# EAGLE board BRD1001-X00-002 - Switching Register (EAGLE 9.4.2), part 1 of 2
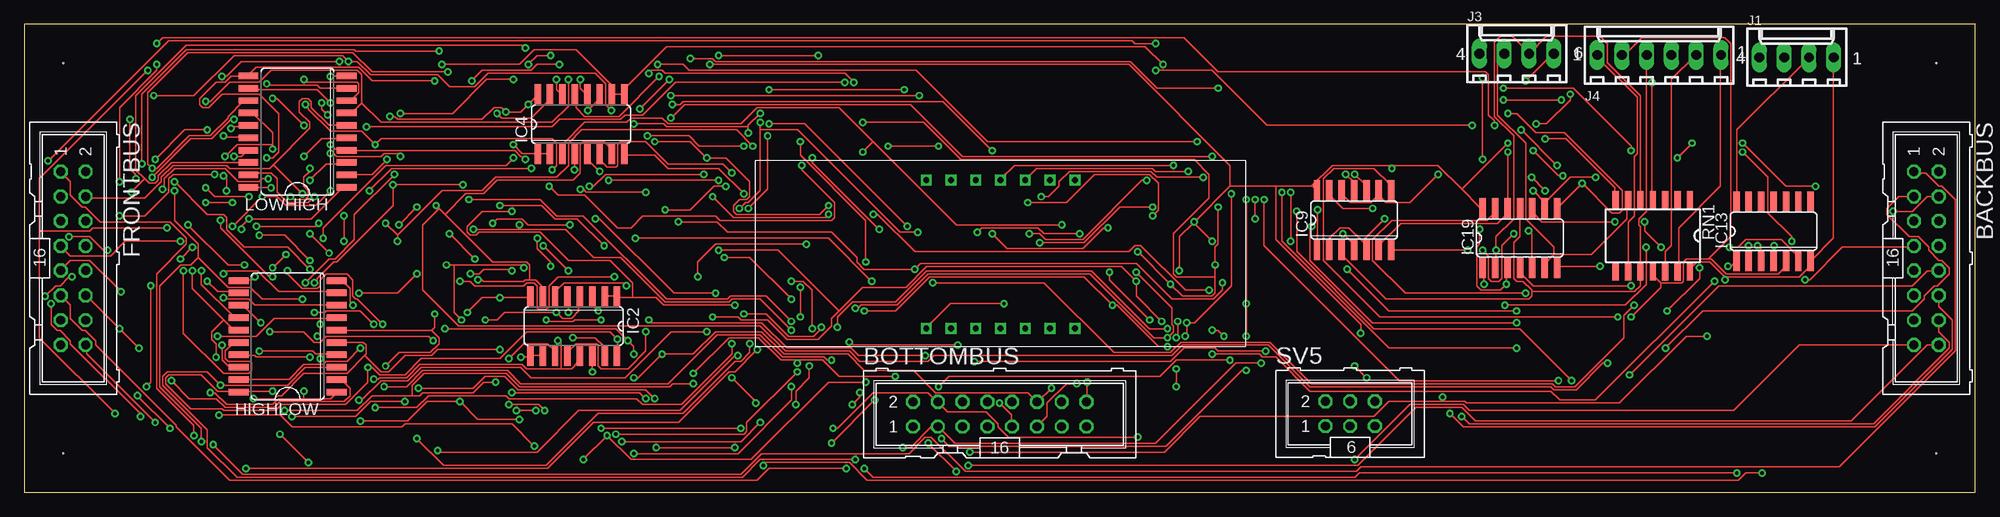
[diagram p1: board, top side]
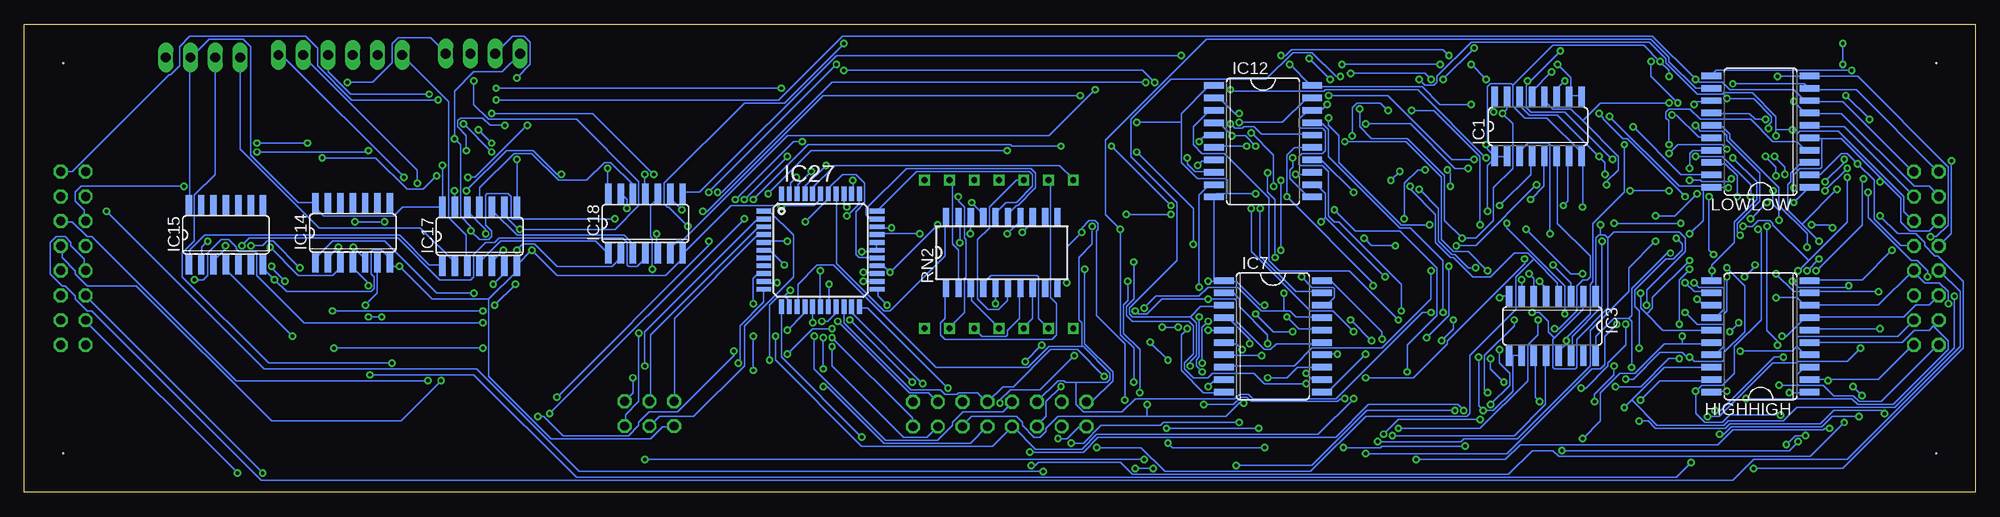
[diagram p2: board, bottom side, seen from below]

Size 200 x 48 mm. Coordinates in mm from the lower left corner, seen from the top.
Outline: 0,0 200,0 200,48 0,48 0,0
Copper layers (1*16): Top 0.035mm / dielectric 1.5mm / Bottom 0.035mm
Design rules "default": minimum track width 6mil, minimum drill 0.35mm, track to track 6mil, track to pad 6mil, pad to pad 6mil, via to via 6mil, smd to smd 6mil, copper to edge 40mil, drill to drill 6mil, minimum pad ring 10mil, minimum via ring 8mil, stop-mask expansion 4mil, vias tented up to drill 0mil, thermal gap 10mil
Holes 0.12 mm at 4,4 196,44 4,44 196,4

## Footprints (pad centres in the part's own frame; a part is rotated, then mirrored left to right if it is on the bottom)
ML16 = drill 0.914 octagon: 1 -8.89,-1.27; 2 -8.89,1.27; 3 -6.35,-1.27; 4 -6.35,1.27; 5 -3.81,-1.27; 6 -3.81,1.27; 7 -1.27,-1.27; 8 -1.27,1.27; 9 1.27,-1.27; 10 1.27,1.27; 11 3.81,-1.27; 12 3.81,1.27; 13 6.35,-1.27; 14 6.35,1.27; 15 8.89,-1.27; 16 8.89,1.27
SO20W = smd 0.66 x 2.032: 1 -5.715,-5.029; 2 -4.445,-5.029; 3 -3.175,-5.029; 4 -1.905,-5.029; 5 -0.635,-5.029; 6 0.635,-5.029; 7 1.905,-5.029; 8 3.175,-5.029; 9 4.445,-5.029; 10 5.715,-5.029; 11 5.715,5.029; 12 4.445,5.029; 13 3.175,5.029; 14 1.905,5.029; 15 0.635,5.029; 16 -0.635,5.029; 17 -1.905,5.029; 18 -3.175,5.029; 19 -4.445,5.029; 20 -5.715,5.029
SO16 = smd 0.66 x 2.032: 1 -4.445,-3.073; 2 -3.175,-3.073; 3 -1.905,-3.073; 4 -0.635,-3.073; 5 0.635,-3.073; 6 1.905,-3.073; 7 3.175,-3.073; 8 4.445,-3.073; 9 4.445,3.073; 10 3.175,3.073; 11 1.905,3.073; 12 0.635,3.073; 13 -0.635,3.073; 14 -1.905,3.073; 15 -3.175,3.073; 16 -4.445,3.073
SO14 = smd 0.66 x 2.032: 1 -3.81,-3.073; 2 -2.54,-3.073; 3 -1.27,-3.073; 4 0,-3.073; 5 1.27,-3.073; 6 2.54,-3.073; 7 3.81,-3.073; 8 3.81,3.073; 9 2.54,3.073; 10 1.27,3.073; 11 0,3.073; 12 -1.27,3.073; 13 -2.54,3.073; 14 -3.81,3.073
TQFP44 = smd 1.5 x 0.5: 1 -5.8,4; 2 -5.8,3.2; 3 -5.8,2.4; 4 -5.8,1.6; 5 -5.8,0.8; 6 -5.8,0; 7 -5.8,-0.8; 8 -5.8,-1.6; 9 -5.8,-2.4; 10 -5.8,-3.2; 11 -5.8,-4; 23 5.8,-4; 24 5.8,-3.2; 25 5.8,-2.4; 26 5.8,-1.6; 27 5.8,-0.8; 28 5.8,0; 29 5.8,0.8; 30 5.8,1.6; 31 5.8,2.4; 32 5.8,3.2; 33 5.8,4 | smd 0.5 x 1.5: 12 -4,-5.8; 13 -3.2,-5.8; 14 -2.4,-5.8; 15 -1.6,-5.8; 16 -0.8,-5.8; 17 0,-5.8; 18 0.8,-5.8; 19 1.6,-5.8; 20 2.4,-5.8; 21 3.2,-5.8; 22 4,-5.8; 34 4,5.8; 35 3.2,5.8; 36 2.4,5.8; 37 1.6,5.8; 38 0.8,5.8; 39 0,5.8; 40 -0.8,5.8; 41 -1.6,5.8; 42 -2.4,5.8; 43 -3.2,5.8; 44 -4,5.8
6410-04 = drill 1.016 long: 1 3.81,0; 2 1.27,0; 3 -1.27,0; 4 -3.81,0
6410-06 = drill 1.016 long: 1 6.35,0; 2 3.81,0; 3 1.27,0; 4 -1.27,0; 5 -3.81,0; 6 -6.35,0
SOMC14 = smd 1.91 x 0.64: 1 -3.62,3.81; 2 -3.62,2.54; 3 -3.62,1.27; 4 -3.62,0; 5 -3.62,-1.27; 6 -3.62,-2.54; 7 -3.62,-3.81; 8 3.62,-3.81; 9 3.62,-2.54; 10 3.62,-1.27; 11 3.62,0; 12 3.62,1.27; 13 3.62,2.54; 14 3.62,3.81
SOMC20 = smd 1.91 x 0.64: 1 -3.62,5.715; 2 -3.62,4.445; 3 -3.62,3.175; 4 -3.62,1.905; 5 -3.62,0.635; 6 -3.62,-0.635; 7 -3.62,-1.905; 8 -3.62,-3.175; 9 -3.62,-4.445; 10 -3.62,-5.715; 11 3.62,-5.715; 12 3.62,-4.445; 13 3.62,-3.175; 14 3.62,-1.905; 15 3.62,-0.635; 16 3.62,0.635; 17 3.62,1.905; 18 3.62,3.175; 19 3.62,4.445; 20 3.62,5.715
ML6 = drill 0.914 octagon: 1 -2.54,-1.27; 2 -2.54,1.27; 3 0,-1.27; 4 0,1.27; 5 2.54,-1.27; 6 2.54,1.27
4-DIGIT-7-SEGMENT = drill 0.6 square: PIN1 17.48,1.88; PIN2 20.02,1.88; PIN3 22.56,1.88; PIN4 25.1,1.88; PIN5 27.64,1.88; PIN6 30.18,1.88; PIN7 32.72,1.88; PIN8 32.72,17.12; PIN9 30.18,17.12; PIN10 27.64,17.12; PIN11 25.1,17.12; PIN12 22.56,17.12; PIN13 20.02,17.12; PIN14 17.48,17.12

## Placement (x,y rotation side)
BACKBUS  [ML16]  195,24 270 top
BOTTOMBUS  [ML16]  100,8 0 top
FRONTBUS  [ML16]  5,24 270 top
HIGHHIGH  74AC245DW  [SO20W]  22,16 90 bottom
HIGHLOW  74AC245DW  [SO20W]  27,16 90 top
IC1  74HC173D  [SO16]  44.8,37.53 0 bottom
IC2  74HC173D  [SO16]  56.32,17.04 180 top
IC3  74HC173D  [SO16]  43.34,17.05 180 bottom
IC4  74HC173D  [SO16]  57.07,37.75 0 top
IC7  74AC245DW  [SO20W]  72,16 270 bottom
IC9  74ALS02D  [SO14]  136.33,27.93 0 top
IC12  74AC245DW  [SO20W]  73,36 270 bottom
IC13  74ALS02D  [SO14]  179.33,26.77 0 top
IC14  74ALS00D  [SO14]  166.33,26.61 0 bottom
IC15  74ALS04D  [SO14]  179.33,26.41 0 bottom
IC17  74ALS02D  [SO14]  153.33,26.25 0 bottom
IC18  74ALS04D  [SO14]  136.33,27.57 0 bottom
IC19  74ALS02D  [SO14]  153.33,26.09 0 top
IC27  MEGA8535-A  [TQFP44]  118.38,24.83 0 bottom
J1  22-27-2041-04  [6410-04]  181.7,44.61 0 top
J3  22-27-2041-04  [6410-04]  153,45 0 top
J4  22-27-2061-06  [6410-06]  167.6,44.86 0 top
LOWHIGH  74AC245DW  [SO20W]  28,37 90 top
LOWLOW  74AC245DW  [SO20W]  22,37 90 bottom
RN1  [SOMC14]  166.95,26.32 270 top
RN2  [SOMC20]  99.79,24.59 90 bottom
SV5  [ML6]  135.92,8.05 0 top
U$1  4-DIGIT-7-SEGMENT  [4-DIGIT-7-SEGMENT]  74.98,14.92 0 top

## Tracks (layer width: path | path; a pad name or v marks a point on that pad's centre or on a via)
!HIGH_HIGH  (via drill 0.35)
  Top 0.152: v34.29,9.45 34.59,9.45 36.58,11.43 39.32,11.43 40.69,12.8 50.9,12.8 51.97,11.73 61.57,11.73 66.29,16.46 v69.95,16.46 | v73.76,18.29 76.05,18.29 78.33,16 80.92,16 81.69,16.76 v81.69,16.92 | v83.36,16.92 83.36,17.98 84.89,19.51 89.31,19.51 92.51,22.71 109.42,22.71 115.37,16.76 v117.2,16.76 | v121.77,14.17 126.64,14.17 126.95,13.87 128.32,13.87 131.83,10.36 156.51,10.36 157.43,9.45 161.09,9.45 v173.28,21.64 | v174.65,23.16 174.96,23.16 175.41,23.62 IC13.1
  Bottom 0.152: v34.29,9.45 32.31,11.43 27.13,11.43 HIGHHIGH.19 | v69.95,16.46 71.93,16.46 v73.76,18.29 | v83.36,16.92 v81.69,16.92 | v117.2,16.76 119.18,16.76 v121.77,14.17 | v173.28,21.64 174.65,23.01 v174.65,23.16
!HIGH_LOW  (via drill 0.35)
  Top 0.152: v34.44,14.78 33.07,13.41 30.94,13.41 30.63,13.11 28.65,13.11 27.13,11.58 22.1,11.58 HIGHLOW.19 | v30.63,26.06 30.63,27.13 37.03,33.53 49.38,33.53 v50.14,34.29 | v90.22,41.3 v76.35,41.3
  Bottom 0.152: v34.44,14.78 34.44,18.59 34.9,19.05 34.9,20.73 31.7,23.93 30.94,23.93 30.02,24.84 30.02,25.45 v30.63,26.06 | v50.14,34.29 57.15,41.3 66.6,41.3 66.75,41.15 76.2,41.15 v76.35,41.3 | v90.22,41.3 94.94,36.58 121.77,36.58 132.59,25.76 133.04,25.76 133.66,25.15 133.66,24.54 IC18.6
!LOW_HIGH  (via drill 0.35)
  Top 0.152: v71.17,44.81 v81.38,44.81 | v53.95,44.81 52.58,44.81 v51.66,43.89 | v50.14,42.37 47.4,42.37 43.89,38.86 v38.56,38.86 | v29.72,30.33 29.11,29.72 26.98,29.72 25.91,30.79 25.91,32.16 25.3,32.77 23.16,32.77 23.01,32.61 LOWHIGH.19
  Bottom 0.152: v81.38,44.81 116.74,44.81 130.76,30.79 132.44,30.79 IC18.8 | v71.17,44.81 70.71,44.81 70.1,45.41 54.56,45.41 v53.95,44.81 | v50.14,42.37 v51.66,43.89 | v38.56,38.86 38.1,38.41 38.1,38.25 36.12,36.27 35.66,36.27 v29.72,30.33
!LOW_LOW  (via drill 0.35)
  Top 0.152: v154.53,32.31 v155.91,30.94 | v148.44,37.64 127.41,37.64 121.77,43.28 v115.98,43.28 | v84.12,42.06 66.75,42.06 63.4,38.71 61.57,38.71 61.11,38.25 54.86,38.25 54.1,37.49 v35.05,37.49
  Bottom 0.152: v155.91,30.94 155.91,29.41 IC17.13 | v154.53,32.31 153.77,32.31 v148.44,37.64 | v115.98,43.28 85.34,43.28 v84.12,42.06 | v35.05,37.49 30.18,32.61 27.13,32.61 LOWLOW.19
!REG_IN  (via drill 0.35)
  Top 0.152: v42.82,43.89 50.75,43.89 52.27,45.41 56.54,45.41 60.2,41.76 60.2,40.84 IC4.10 60.35,40.84 61.42,40.84 IC4.9 61.57,40.84 61.57,41.45 65.84,45.72 114.91,45.72 v116.74,43.89 | IC2.10 53.03,14.02 51.97,14.02 IC2.9 51.82,13.87 v50.9,13.87 | v172.52,16 170.38,16 163.53,9.14 147.83,9.14 147.68,9.3 145.39,9.3 | 145.39,9.3 139.9,9.3 138.38,7.77 120.55,7.77 116.89,4.12 v96.93,4.12 | v50.44,8.38 v52.43,8.38 | v129.84,25.76 v129.84,30.79 | 145.39,9.3 v145.39,9.75
  Bottom 0.152: 41.45,40.69 41.6,40.69 IC1.10 41.45,40.69 | 41.45,40.69 40.39,40.69 IC1.9 | 41.45,40.69 41.45,42.52 v42.82,43.89 | 47.4,14.02 47.7,14.02 IC3.9 | 47.4,14.02 46.63,14.02 IC3.10 | v172.52,16 179.22,22.71 179.22,23.32 IC15.4 | v96.93,4.12 91.44,4.12 89.92,5.64 65.53,5.64 62.18,8.99 53.03,8.99 v52.43,8.38 | 47.4,14.02 47.4,10.36 49.38,8.38 v50.44,8.38 50.9,8.84 v50.9,13.87 | v129.84,30.79 v116.74,43.89 | v129.84,25.76 129.84,25.3 v145.39,9.75
!REG_OUT  (via drill 0.35)
  Top 0.152: v19.05,10.21 19.51,10.21 20.73,8.99 25.45,8.99 26.06,9.6 28.65,9.6 | 28.65,9.6 31.39,9.6 32,10.21 HIGHLOW.1 | v21.34,29.72 v18.59,29.72 | LOWHIGH.1 32.92,31.24 32.61,31.24 29.41,28.04 v23.01,28.04 22.25,27.28 v22.25,26.98 | v28.65,10.36 28.65,9.6 | v73.3,29.11 73.91,29.72 74.22,29.72 75.44,30.94 75.44,37.19 | v75.44,37.95 75.44,37.19 | v165.05,19.2 163.98,18.14 163.98,15.85 158.95,10.82 156.97,10.82 156.67,11.12 131.98,11.12 127.71,15.39 118.57,15.39 117.5,14.33 111.71,14.33 104.55,21.49 v93.12,21.49 | v91.59,26.67 89.76,26.67 79.25,37.19 75.44,37.19 | v19.96,7.92 26.21,7.92 27.43,6.71 38.71,6.71 39.01,7.01 49.99,7.01 v52.27,4.72 | v72.85,4.57 v64.77,4.57 | v87.17,9.45 v82.75,5.03
  Bottom 0.152: v19.05,10.21 17.07,10.21 HIGHHIGH.1 | v18.59,29.72 17.07,31.24 LOWLOW.1 | v23.01,28.04 v21.34,29.72 | v22.25,26.98 21.95,26.67 21.95,17.68 24.69,14.94 24.69,12.19 25.91,10.97 28.04,10.97 v28.65,10.36 28.65,8.08 27.74,7.16 25.91,7.16 25.15,7.92 v19.96,7.92 | v73.3,29.11 73.3,24.23 69.65,20.57 67.06,20.57 IC7.19 | v75.44,37.95 71.02,37.95 68.58,40.39 68.12,40.39 IC12.19 | v165.05,19.2 163.83,20.42 163.83,23.47 IC14.6 | v93.12,21.49 93.12,25.15 v91.59,26.67 91.59,27.13 90.83,27.89 90.22,27.89 89.92,27.58 89.92,26.98 90.07,26.82 90.07,18.14 87.17,15.24 v87.17,9.45 | v52.27,4.72 60.81,4.72 60.96,4.57 v64.77,4.57 | v72.85,4.57 82.3,4.57 v82.75,5.03
A
  Bottom 0.152: IC27.37 116.74,30.48 116.74,23.47 111.86,18.59 111.25,18.59 105.61,24.23 105.61,28.19 RN2.20
B  (via drill 0.35)
  Top 0.152: v115.67,29.26 112.32,29.26 108.66,25.6 v104.09,25.6
  Bottom 0.152: v115.67,29.26 115.98,29.57 115.98,30.48 IC27.36 | v104.09,25.6 104.09,28.19 RN2.19
BUS0  (via drill 0.35)
  Top 0.152: v34.44,7.32 39.32,7.32 41.3,9.3 v44.65,9.3 46.48,7.47 v50.75,7.47 | v9.3,8.08 1.52,15.85 1.52,26.82 | 1.52,26.82 1.52,32.16 v12.65,43.28 | v23.62,22.1 23.32,21.79 22.1,21.79 HIGHLOW.11 | v22.55,23.32 20.88,23.32 v16.76,27.43 | v14.63,27.13 7.01,27.13 6.71,26.82 1.52,26.82 | v79.55,17.98 v79.55,21.03 | v79.25,12.34 74.07,7.16 74.07,6.25 73.76,5.94 v60.66,5.94
  Bottom 0.152: v44.65,9.3 45.11,9.75 45.11,13.87 IC3.11 | v34.44,7.32 33.53,7.32 32.77,6.55 25.6,6.55 25.15,7.01 15.85,7.01 14.48,8.38 9.6,8.38 v9.3,8.08 | v12.65,43.28 26.52,43.28 26.98,42.82 LOWLOW.11 | v23.62,22.1 22.55,23.16 v22.55,23.32 | v16.76,27.43 14.94,27.43 v14.63,27.13 | v79.55,21.03 79.55,30.48 78.49,31.55 78.18,31.55 IC12.9 | v79.55,17.98 79.55,13.87 79.86,13.56 79.86,12.95 v79.25,12.34 | v60.66,5.94 59.13,7.47 v50.75,7.47
BUS1  (via drill 0.35)
  Top 0.152: v86.26,11.28 82.45,11.28 74.52,3.35 62.18,3.35 v59.74,5.79 v57.3,3.35 | v87.63,26.98 80.77,33.83 v80.77,34.29 | v18.75,21.64 19.81,20.57 21.95,20.57 HIGHLOW.12 | v12.95,21.18 12.95,11.28 v12.5,10.82 | v14.94,6.55 v11.58,9.91
  Bottom 0.152: v59.74,5.79 47.24,5.79 44.04,8.99 44.04,13.87 IC3.12 | v86.26,11.28 86.26,14.78 87.63,16.15 v87.63,26.98 89.15,28.5 89.15,36.12 78.79,46.48 33.22,46.48 31.39,44.65 31.39,44.2 28.65,41.45 27.13,41.45 LOWLOW.12 | v80.77,34.29 80.77,33.68 80.01,32.92 78.18,32.92 IC12.8 | v18.75,21.64 18.14,21.03 13.11,21.03 v12.95,21.18 | v11.58,9.91 v12.5,10.82 | v14.94,6.55 15.39,6.55 15.54,6.4 24.84,6.4 26.36,4.88 46.63,4.88 48.16,3.35 v57.3,3.35
BUS2  (via drill 0.35)
  Top 0.152: v24.23,17.37 22.55,19.05 22.1,19.05 HIGHLOW.13 | v25.15,16.46 28.65,16.46 29.72,15.39 30.33,15.39 30.94,16 41.45,16 v41.91,15.54 | v28.8,39.78 29.11,39.47 29.11,39.32 31.39,37.03 34.59,37.03 v35.97,35.66 36.58,36.27 54.1,36.27 54.56,35.81 54.56,33.53 v54.1,33.07 | v79.7,33.53 79.7,33.07 83.06,29.72 83.06,28.19 82.75,27.89 71.32,27.89 70.87,28.35 63.4,28.35 62.18,27.13 60.81,27.13 57.45,30.48 54.71,30.48 v53.8,31.39
  Bottom 0.152: v25.15,16.46 v24.23,17.37 | IC3.13 42.67,14.02 42.67,14.48 41.91,15.24 v41.91,15.54 41.91,15.85 39.47,18.29 39.47,21.34 39.17,21.64 39.17,27.58 35.97,30.79 v35.97,35.66 | v28.8,39.78 28.5,40.08 27.13,40.08 LOWLOW.13 | v79.7,33.53 79.25,33.98 78.18,33.98 IC12.7 | v53.8,31.39 53.8,32.77 v54.1,33.07
BUS3  (via drill 0.35)
  Top 0.152: v18.14,22.71 18.14,21.34 21.49,17.98 21.95,17.98 HIGHLOW.14 | v13.11,32.31 17.07,36.27 19.2,36.27 21.18,38.25 v21.49,38.25 | 38.25,26.36 v38.25,25.76 | 38.25,26.36 42.82,30.94 46.94,30.94 48.31,32.31 54.56,32.31 55.78,33.53 55.78,35.81 57.15,37.19 73,37.19 v74.68,35.51 | v23.77,27.28 29.87,27.28 v30.18,27.58 | 38.25,26.36 v37.03,27.58
  Bottom 0.152: 17.07,23.77 13.11,27.74 v13.11,32.31 | 17.07,23.77 v18.14,22.71 | v21.49,38.25 22.55,38.25 23.16,38.86 26.98,38.86 LOWLOW.14 | v38.25,25.76 38.25,19.05 41.3,16 41.3,14.02 IC3.14 | v74.68,35.51 78.03,35.51 IC12.6 | 17.07,23.77 20.73,27.43 20.73,27.58 21.03,27.89 22.25,27.89 22.86,27.28 v23.77,27.28 | v37.03,27.58 v30.18,27.58
BUS4  (via drill 0.35)
  Top 0.152: 20.42,17.68 17.22,20.88 v17.22,22.71 | 20.42,17.68 21.34,16.76 21.95,16.76 HIGHLOW.15 | v17.22,25.15 v16,23.93 | v49.68,13.72 51.21,15.24 53.65,15.24 54.41,14.48 54.41,14.02 IC2.11 | v48.31,11.28 47.09,11.28 46.02,10.21 40.84,10.21 40.54,9.91 39.78,9.91 | 39.78,9.91 35.66,9.91 34.14,8.38 v26.67,8.38 | v19.66,13.87 19.66,15.24 19.2,15.7 19.2,16.46 20.42,17.68 | v79.55,35.97 79.55,34.59 86.26,27.89 v86.26,23.62 | v68.58,11.12 66.45,11.12 66.14,10.82 50.75,10.82 49.38,12.19 41,12.19 39.78,10.97 39.78,9.91
  Bottom 0.152: v16,23.93 v17.22,22.71 | v17.22,25.15 17.22,26.52 20.12,29.41 20.12,31.24 25.15,36.27 25.15,36.73 25.91,37.49 26.98,37.49 LOWLOW.15 | v49.68,13.72 49.68,12.65 v48.31,11.28 | v26.67,8.38 26.06,8.38 20.57,13.87 v19.66,13.87 | v79.55,35.97 78.94,36.58 78.18,36.58 IC12.5 | v86.26,23.62 86.26,19.81 87.02,19.05 87.02,18.14 86.41,17.53 80.62,17.53 80.16,17.07 80.16,14.17 81.08,13.26 81.08,12.65 80.16,11.73 78.64,11.73 78.18,12.19 73.91,12.19 72.85,11.12 v68.58,11.12
BUS5  (via drill 0.35)
  Top 0.152: v63.7,16.46 63.7,14.48 61.87,12.65 59.13,12.65 58.83,12.95 58.83,15.09 58.67,15.24 56.54,15.24 55.78,14.48 55.78,14.02 IC2.12 | v74.22,29.11 76.2,31.09 v76.2,36.58 | v16.31,22.71 16.31,16.31 20.42,12.19 23.01,12.19 23.32,12.5 23.32,13.26 23.16,13.41 20.88,13.41 20.57,13.72 20.57,14.48 21.34,15.24 21.95,15.24 HIGHLOW.16 | v11.43,32.16 11.43,32.61 10.82,33.22 v10.82,38.25 | v13.26,40.69 17.37,40.69 21.49,44.81 32.61,44.81 v33.22,44.2 34.14,44.2 35.51,42.82 42.37,42.82 43.59,41.6 46.18,41.6 47.55,42.98 58.52,42.98 59.59,41.91 59.59,39.78 v60.2,39.17 | v30.48,39.93 30.48,39.32 v31.09,38.71 | v73.76,35.51 69.19,35.51 68.12,36.58 v63.86,36.58
  Bottom 0.152: v63.7,16.46 65.84,18.59 68.12,18.59 74.22,24.69 v74.22,29.11 | IC12.4 78.03,37.8 77.42,37.8 v76.2,36.58 74.83,36.58 v73.76,35.51 | v16.31,22.71 11.58,27.43 11.58,32 v11.43,32.16 | v13.26,40.69 v10.82,38.25 | v33.22,44.2 33.22,42.67 v30.48,39.93 | v31.09,38.71 30.63,38.71 28.35,36.42 27.13,36.42 LOWLOW.16 | v63.86,36.58 63.86,39.47 63.4,39.93 60.96,39.93 v60.2,39.17
BUS6  (via drill 0.35)
  Top 0.152: v29.26,13.87 23.77,13.87 23.62,14.02 22.1,14.02 HIGHLOW.17 | v35.81,11.58 36.27,11.58 36.42,11.73 39.17,11.73 40.54,13.11 51.05,13.11 51.51,12.65 55.02,12.65 | 55.02,12.65 56.08,12.65 56.84,13.41 56.84,13.87 IC2.13 | v29.26,33.22 29.26,32.92 28.65,32.31 28.65,31.39 29.11,30.94 29.11,30.33 28.8,30.02 27.58,30.02 v27.28,30.33 | v25.45,23.01 v26.82,24.38 | v59.13,17.68 56.39,17.68 56.24,17.53 53.65,17.53 v53.49,17.68 | v54.71,15.54 55.02,15.24 55.02,12.65
  Bottom 0.152: v35.81,11.58 35.05,11.58 32.31,14.33 30.02,14.33 29.57,13.87 v29.26,13.87 28.8,13.41 25.91,13.41 25.76,13.56 25.76,14.33 23.62,16.46 23.62,21.18 v25.45,23.01 | v29.26,33.22 29.26,34.75 28.96,35.05 27.13,35.05 LOWLOW.17 | v27.28,30.33 27.28,24.84 v26.82,24.38 | v59.13,17.68 64.16,22.71 71.32,22.71 72.39,23.77 72.39,30.18 76.96,34.75 79.25,34.75 80.16,35.66 80.16,37.49 78.49,39.17 78.18,39.17 IC12.3 | v53.49,17.68 53.49,16.76 v54.71,15.54
BUS7  (via drill 0.35)
  Top 0.152: v20.27,15.09 20.27,13.56 20.88,12.95 21.95,12.95 HIGHLOW.18 | v21.34,27.28 v24.38,30.33 25.91,30.33 26.82,29.41 29.87,29.41 v31.39,30.94 | v58.22,12.34 58.22,13.87 IC2.14 | v65.68,28.96 68.28,28.96 70.71,31.39 v71.93,31.39 | 74.22,37.49 74.22,37.64 v75.44,38.86 | 74.22,37.49 v74.22,36.88 | v35.36,30.94 37.64,33.22 v51.97,33.22 | v62.48,37.8 65.53,37.8 65.84,37.49 74.22,37.49
  Bottom 0.152: v20.27,15.09 20.27,15.54 21.34,16.61 v21.34,27.28 | v24.38,30.33 24.38,32.46 25.6,33.68 26.98,33.68 LOWLOW.18 | v58.22,12.34 58.22,15.09 55.17,18.14 55.17,23.01 58.98,26.82 63.55,26.82 v65.68,28.96 | v71.93,31.39 71.93,34.59 v74.22,36.88 | v75.44,38.86 75.89,38.86 77.42,40.39 78.03,40.39 IC12.2 | v35.36,30.94 v31.39,30.94 | v51.97,33.22 53.34,33.22 57.91,37.8 v62.48,37.8
BUS8  (via drill 0.35)
  Top 0.152: v24.84,34.29 25.45,34.29 26.06,34.9 26.06,38.86 24.08,40.84 20.27,40.84 18.9,39.47 18.29,39.47 17.98,39.78 17.98,40.39 19.66,42.06 20.57,42.06 21.18,42.67 22.86,42.67 LOWHIGH.11 23.01,42.82 23.77,43.59 34.29,43.59 35.66,42.22 v42.06,42.22 | v78.64,10.82 78.64,9.45 73.15,3.96 v62.48,3.96 | v36.73,17.22 34.14,19.81 33.98,19.81 33.68,20.12 33.68,21.79 33.07,22.4 30.94,22.4 30.33,21.79 30.33,21.18 30.02,20.88 28.5,20.88 26.98,22.4 v26.98,22.71
  Bottom 0.152: v24.84,34.29 22.4,31.85 22.4,30.02 24.69,27.74 24.69,25.6 26.98,23.32 v26.98,22.71 26.98,21.79 HIGHHIGH.11 | v42.06,42.22 42.82,41.45 42.82,40.69 IC1.11 | v78.64,10.82 78.03,11.43 77.11,11.43 IC7.9 | v62.48,3.96 48.01,3.96 39.32,12.65 38.41,12.65 37.95,13.11 37.95,16 v36.73,17.22
BUS9  (via drill 0.35)
  Top 0.152: v29.72,21.49 30.02,21.79 30.02,21.95 31.7,23.62 32,23.62 37.8,29.41 v37.8,31.55 v44.96,31.55 | v53.19,25.3 v55.78,22.71 | v31.39,39.93 30.02,41.3 23.01,41.3 LOWHIGH.12
  Bottom 0.152: v29.72,21.49 28.8,20.57 27.13,20.57 HIGHHIGH.12 | v37.8,31.55 37.8,31.85 36.58,33.07 36.58,34.44 40.23,38.1 | 40.23,38.1 41.45,39.32 43.28,39.32 44.04,40.08 44.04,40.54 IC1.12 | v55.78,22.71 55.78,19.81 60.81,14.78 67.97,14.78 69.8,12.95 76.96,12.95 IC7.8 | v53.19,25.3 51.21,25.3 v44.96,31.55 | v31.39,39.93 38.41,39.93 40.23,38.1
BUS10  (via drill 0.35)
  Top 0.152: v28.5,19.81 24.38,19.81 23.16,21.03 20.88,21.03 17.83,24.08 | 17.83,24.08 17.83,25.45 15.39,27.89 v15.39,30.94 | LOWHIGH.13 22.86,40.08 22.4,40.08 20.88,38.56 20.88,38.41 19.05,36.58 16.92,36.58 13.56,33.22 v13.11,33.22 12.65,33.68 12.65,41 16.76,45.11 33.68,45.11 35.66,43.13 v43.43,43.13 | v73.15,14.02 72.85,14.02 67.21,8.38 56.84,8.38 52.58,4.12 42.52,4.12 v42.37,4.27 | v18.14,5.18 18.14,6.55 13.87,10.82 13.87,21.18 16,23.32 17.07,23.32 17.83,24.08
  Bottom 0.152: v28.5,19.81 27.89,19.2 27.13,19.2 HIGHHIGH.13 | v13.11,33.22 v15.39,30.94 | v73.15,14.02 76.96,14.02 IC7.7 | v42.37,4.27 19.05,4.27 v18.14,5.18 | v43.43,43.13 45.41,41.15 45.41,40.69 IC1.13
BUS11  (via drill 0.35)
  Top 0.152: v25.45,35.2 25.45,35.66 | 25.45,35.66 25.45,36.88 23.47,38.86 23.01,38.86 LOWHIGH.14 | v31.39,34.75 31.7,34.75 32,34.44 36.58,34.44 36.88,34.75 38.25,34.75 v38.56,34.44 | v28.8,21.49 31.24,23.93 31.85,23.93 33.83,25.91 33.83,28.5 v37.95,32.61 | v75.13,14.63 72.85,12.34 72.24,12.34 67.06,7.16 58.37,7.16 53.65,2.44 v22.71,2.44 | v9.75,28.35 12.34,28.35 14.78,30.79 14.78,32.16 15.24,32.61 v19.51,32.61 | v20.57,34.44 21.79,35.66 25.45,35.66
  Bottom 0.152: v25.45,35.2 25.91,35.66 30.48,35.66 v31.39,34.75 | IC1.14 46.63,40.54 46.63,39.62 45.72,38.71 42.82,38.71 v38.56,34.44 37.95,33.83 v37.95,32.61 | v28.8,21.49 28.35,21.03 25.91,21.03 25.76,20.88 25.76,18.75 26.52,17.98 26.98,17.98 HIGHHIGH.14 | v75.13,14.63 75.74,15.24 76.96,15.24 IC7.6 | v22.71,2.44 13.56,2.44 1.22,14.78 1.22,21.64 3.81,24.23 4.12,24.23 5.18,25.3 5.18,25.6 6.1,26.52 7.92,26.52 v9.75,28.35 | v19.51,32.61 19.51,33.38 v20.57,34.44
BUS12  (via drill 0.35)
  Top 0.152: v34.29,20.42 38.25,20.42 v40.23,22.4 | 50.75,26.98 55.47,26.98 58.37,24.08 61.11,24.08 65.68,19.51 72.24,19.51 72.54,19.81 75.44,19.81 v78.64,16.61 | 50.75,26.98 v46.02,26.98 | v21.18,37.34 21.34,37.49 22.86,37.49 LOWHIGH.15 | v25.45,40.39 25.91,40.39 v28.65,37.64 | v24.08,26.36 26.67,26.36 v29.26,23.77 | v57.76,39.17 58.83,40.23 58.83,40.69 IC4.11 | 50.75,26.98 v50.75,27.43
  Bottom 0.152: 33.68,18.29 34.29,18.9 v34.29,20.42 | 33.68,18.29 32,16.61 27.13,16.61 HIGHHIGH.15 | v40.23,22.4 41.45,22.4 v46.02,26.98 | v78.64,16.61 77.11,16.61 IC7.5 | v21.18,37.34 21.18,37.64 20.88,37.95 20.88,38.56 22.71,40.39 v25.45,40.39 | v28.65,37.64 28.35,37.34 28.35,37.19 28.19,37.03 25.91,37.03 25.45,36.58 25.45,36.12 22.1,32.77 22.1,29.87 24.38,27.58 24.38,26.67 v24.08,26.36 | v29.26,23.77 33.07,19.96 33.07,18.9 33.68,18.29 | v57.76,39.17 55.47,39.17 50.75,34.44 v50.75,27.43
BUS13  (via drill 0.35)
  Top 0.152: v20.42,36.58 20.57,36.42 22.86,36.42 LOWHIGH.16 | v57,42.37 57,41.45 57.61,40.84 IC4.12 | v40.23,5.49 42.98,2.74 53.49,2.74 58.83,8.08 67.51,8.08 72.85,13.41 73.46,13.41 74.37,14.33 v74.37,15.24 | v18.75,37.19 16.46,37.19 v13.41,34.14 | v15.39,31.85 18.75,28.5 20.42,28.5 20.73,28.19 20.73,26.98 22.55,25.15 26.98,25.15 v29.26,22.86 | v30.33,17.22 30.33,16.31 v30.02,16
  Bottom 0.152: 20.42,37.19 20.42,38.56 22.86,41 25.76,41 25.91,40.84 28.5,40.84 31.7,44.04 31.7,44.5 33.38,46.18 51.66,46.18 55.17,42.67 55.17,42.06 55.47,41.76 56.39,41.76 v57,42.37 | 20.42,37.19 v20.42,36.58 | 30.02,15.24 31.85,15.24 34.9,12.19 36.42,12.19 38.41,10.21 38.41,7.32 v40.23,5.49 | 30.02,15.24 27.13,15.24 HIGHHIGH.16 | v74.37,15.24 74.37,15.7 76.5,17.83 76.96,17.83 IC7.4 | v18.75,37.19 20.42,37.19 | v13.41,34.14 13.41,33.83 v15.39,31.85 | v29.26,22.86 30.33,21.79 v30.33,17.22 | 30.02,15.24 v30.02,16
BUS14  (via drill 0.35)
  Top 0.152: v25.45,22.1 25.15,22.1 20.12,27.13 v20.12,27.89 | v20.73,30.94 20.73,32.16 v20.42,32.46 | v21.49,34.44 22.25,34.44 22.86,35.05 LOWHIGH.17 | v65.08,42.67 60.96,38.56 57.45,38.56 56.54,39.47 56.54,40.69 IC4.13 | v29.72,18.44 30.79,18.44 30.94,18.59 34.44,18.59 v35.81,17.22 | v40.39,10.67 46.02,10.67 47.24,11.89 49.23,11.89 50.6,10.52 63.7,10.52 v64.62,9.6 | v79.1,8.99 79.1,10.36 80.47,11.73 v80.47,12.95
  Bottom 0.152: 25.76,17.22 25.76,18.29 25.45,18.59 v25.45,22.1 | 25.76,17.22 25.76,14.94 26.52,14.17 26.98,14.17 HIGHHIGH.17 | v20.12,27.89 20.12,28.96 20.73,29.57 v20.73,30.94 | v20.42,32.46 20.42,33.38 v21.49,34.44 | v65.08,42.67 65.53,42.67 67.97,45.11 69.95,45.11 72.69,42.37 82.45,42.37 86.56,38.25 86.56,34.44 81.84,29.72 81.84,23.77 86.72,18.9 86.72,18.29 86.41,17.98 80.47,17.98 | 80.47,17.98 79.4,19.05 77.11,19.05 IC7.3 | 25.76,17.22 28.5,17.22 v29.72,18.44 | v35.81,17.22 35.81,15.09 37.64,13.26 37.64,12.95 39.93,10.67 v40.39,10.67 | v64.62,9.6 65.08,9.6 65.38,9.3 74.22,9.3 74.68,9.75 75.29,9.75 76.05,8.99 v79.1,8.99 | v80.47,12.95 80.47,13.41 79.86,14.02 79.86,17.37 80.47,17.98
BUS15  (via drill 0.35)
  Top 0.152: 12.34,32.16 11.43,33.07 11.43,40.69 16.61,45.87 51.05,45.87 v51.36,45.57 | 12.34,32.16 12.8,31.7 13.41,31.7 13.72,32 13.72,32.46 15.09,33.83 22.86,33.83 LOWHIGH.18 | v54.56,42.37 54.56,41.3 55.02,40.84 IC4.14 | v35.97,8.69 40.23,8.69 41.45,9.91 49.38,9.91 49.68,9.6 62.79,9.6 63.4,8.99 67.36,8.99 72.54,14.17 v72.54,15.24 | v10.97,30.79 12.34,32.16 | v4.88,22.1 4.57,22.1 3.66,21.18 3.2,21.18 v2.13,20.12
  Bottom 0.152: v54.56,42.37 v51.36,45.57 | v35.97,8.69 35.2,9.45 | 35.2,9.45 31.85,12.8 27.13,12.8 HIGHHIGH.18 | v72.54,15.24 72.54,16.15 75.44,19.05 75.44,19.81 76.05,20.42 76.96,20.42 IC7.2 | v10.97,30.79 10.97,28.19 6.55,23.77 5.94,23.77 4.88,22.71 v4.88,22.1 | v2.13,20.12 2.13,14.78 8.23,8.69 18.29,8.69 19.66,7.32 25.3,7.32 25.76,6.86 32.61,6.86 35.2,9.45
C  (via drill 0.35)
  Top 0.152: v115.06,32 114.61,32 108.51,25.91 104.7,25.91 104.09,26.52 v103.02,26.52
  Bottom 0.152: v115.06,32 115.06,30.63 IC27.35 | v103.02,26.52 103.02,28.19 RN2.18
CLEAR  (via drill 0.35)
  Top 0.152: v48.46,38.86 48.92,38.41 51.97,38.41 53.8,40.23 53.8,40.69 IC4.15 | v56.24,15.85 58.52,15.85 59.44,14.94 59.44,14.02 IC2.15 | v53.95,23.16 53.95,23.62 52.58,24.99 v52.58,26.06 | v181.2,25.76 181.2,26.21 178.76,28.65 178.76,32.31 v176.17,34.9 | v164.74,35.05 164.74,35.51 158.8,41.45 v151.64,41.45 | v122.38,41.45 116.13,41.45 113.39,44.2 70.87,44.2 70.56,44.5 v68.28,44.5 | v63.09,39.32 v66.14,42.37
  Bottom 0.152: IC1.15 48.01,40.54 48.01,39.32 v48.46,38.86 47.4,37.8 47.4,33.22 49.38,31.24 49.38,27.89 51.21,26.06 v52.58,26.06 54.41,27.89 54.41,32.46 58.22,36.27 61.87,36.27 63.09,37.49 v63.09,39.32 | v56.24,15.85 53.95,18.14 v53.95,23.16 | v181.2,25.76 181.81,25.15 181.81,23.47 IC15.2 | v176.17,34.9 164.9,34.9 v164.74,35.05 | v122.38,41.45 v151.64,41.45 | v66.14,42.37 v68.28,44.5
CLK  (via drill 0.35)
  Top 0.152: v46.48,21.79 46.94,21.79 47.09,21.64 51.21,21.64 51.36,21.79 51.82,21.79 | 51.82,21.79 52.43,21.79 53.03,21.18 53.03,20.12 IC2.7 | 43.13,28.5 48.01,23.62 51.51,23.62 51.82,23.32 51.82,21.79 | 43.13,28.5 42.52,29.11 | 42.52,29.11 v42.22,29.41 | 43.13,28.5 45.26,30.63 47.09,30.63 48.46,32 56.24,32 57,32.77 57,35.66 57.3,35.97 59.44,35.97 60.2,35.2 60.2,34.75 IC4.7 | v162.31,13.26 161.85,13.26 159.11,10.52 156.82,10.52 156.51,10.82 131.83,10.82 127.56,15.09 118.72,15.09 117.65,14.02 93.27,14.02 92.66,13.41 85.65,13.41 84.58,14.48 78.03,14.48 75.44,17.07 44.5,17.07 40.84,20.73 40.84,27.43 42.52,29.11
  Bottom 0.152: v46.48,21.79 46.48,20.27 IC3.7 | v42.22,29.41 41.76,29.87 41.76,34.44 IC1.7 | v162.31,13.26 174.96,13.26 183.79,22.1 183.79,24.54 182.57,25.76 182.57,30.48 180.44,32.61 180.44,44.5 J1.3
D  (via drill 0.35)
  Top 0.152: v115.67,28.35 116.28,28.96 116.28,31.7 115.37,32.61 109.73,32.61 106.83,29.72 v102.87,29.72
  Bottom 0.152: v115.67,28.35 114.45,29.57 114.45,30.48 IC27.34 | v102.87,29.72 101.8,28.65 101.8,28.35 RN2.17
DIG0
  Bottom 0.152: IC27.40 119.18,31.24 116.89,33.53 93.88,33.53 92.51,32.16 U$1.PIN14
DIG1  (via drill 0.35)
  Top 0.152: v117.81,33.53 101.5,33.53 100.13,32.16 U$1.PIN11
  Bottom 0.152: v117.81,33.53 119.94,31.39 119.94,30.63 IC27.41
DIG2  (via drill 0.35)
  Top 0.152: v119.33,32.92 115.98,32.92 115.67,33.22 103.78,33.22 102.72,32.16 U$1.PIN10
  Bottom 0.152: v119.33,32.92 120.7,31.55 120.7,30.63 IC27.42
DIG3  (via drill 0.35)
  Top 0.152: v120.85,32.31 116.13,32.31 115.52,32.92 107.14,32.92 106.07,31.85 106.07,31.39 105,30.33 v104.24,30.33
  Bottom 0.152: v120.85,32.31 121.46,31.7 121.46,30.63 IC27.43 | v104.24,30.33 104.24,29.87 103.63,29.26 103.63,26.06 103.48,25.91 103.48,22.1 103.63,21.95 103.63,18.44 105.16,16.92 U$1.PIN6
DP  (via drill 0.35)
  Top 0.152: v108.2,26.52 104.55,26.52 103.94,27.13 98.15,27.13 v97.69,26.67
  Bottom 0.152: v108.2,26.52 112.47,26.52 IC27.30 | v97.69,26.67 96.62,27.74 96.62,28.19 RN2.13
E
  Bottom 0.152: IC27.33 112.47,28.96 108.51,32.92 96.93,32.92 96.62,32.61 96.62,31.39 98.3,29.72 99.36,29.72 100.28,28.8 100.28,28.35 RN2.16
F
  Bottom 0.152: IC27.32 112.62,28.04 113.23,28.04 113.69,28.5 113.69,29.11 109.58,33.22 96.77,33.22 96.32,32.77 96.32,31.24 98.15,29.41 98.3,29.41 99.06,28.65 99.06,28.35 RN2.15
G  (via drill 0.35)
  Top 0.152: v111.1,27.13 110.64,27.13 108.51,24.99 100.74,24.99 v99.21,26.52
  Bottom 0.152: v111.1,27.13 112.47,27.13 IC27.31 | v99.21,26.52 97.99,27.74 97.99,28.19 RN2.14
GND  (via drill 0.35)
  Top 0.152: IC2.2 59.59,20.12 60.66,20.12 IC2.1 60.81,19.96 62.33,19.96 | v80.77,16.76 80.77,20.73 79.86,21.64 v78.64,21.64 | v73.76,30.63 71.17,33.22 65.99,33.22 64.62,34.59 61.57,34.59 IC4.8 | 62.33,19.96 64.77,19.96 65.53,19.2 v72.85,19.2 | v8.53,24.84 8.08,24.84 6.71,26.21 v4.57,26.21 | IC4.2 53.8,34.75 52.73,34.75 IC4.1 52.58,34.75 51.05,34.75 v50.14,35.66 | v31.39,42.67 32.92,42.67 LOWHIGH.10 | IC2.8 51.82,19.96 v48.77,19.96 46.94,19.96 v45.41,18.44 | v33.68,19.2 33.38,19.51 33.38,20.88 32.61,21.64 32.16,21.64 HIGHLOW.10 | v38.41,27.43 v40.23,29.26 | v20.27,42.67 20.73,42.67 22.25,44.2 v32.31,44.2 | 62.33,19.96 62.33,21.49 60.05,23.77 55.78,23.77 52.88,26.67 46.63,26.67 46.33,26.36 45.72,26.36 45.41,26.67 45.41,27.28 46.94,28.8 v49.99,28.8 | 174.35,22.1 172.82,23.62 171.45,23.62 170.84,23.01 170.84,22.71 RN1.14 | 174.35,22.1 181.97,22.1 183.03,23.16 183.03,23.62 IC13.7 183.19,23.77 185.47,26.06 185.47,44.5 J1.1 | v114.15,24.69 v117.5,21.34 118.72,20.12 121.77,20.12 122.07,20.42 122.07,22.1 | 122.07,22.1 v122.07,23.32 122.07,25.15 122.38,25.45 v122.38,29.26 | v161.54,23.16 157.28,23.16 IC19.7 | v147.98,24.84 140.21,24.84 IC9.7 | v174.35,21.79 174.35,22.1 | v85.95,37.95 92.2,37.95 96.01,34.14 119.94,34.14 121.46,32.61 121.46,30.18 117.81,26.52 117.81,22.4 118.11,22.1 122.07,22.1
  Bottom 0.152: v80.77,16.76 81.38,16.15 81.38,12.5 79.1,10.21 77.11,10.21 IC7.10 | 78.03,21.64 77.11,21.64 IC7.1 | 78.03,21.64 v78.64,21.64 | 78.03,21.64 78.03,30.18 IC12.10 78.03,30.33 77.72,30.63 76.66,30.63 | 78.03,21.64 IC7.1 | 76.66,30.63 v73.76,30.63 | 81.38,37.95 81.38,33.83 79.7,32.16 76.81,32.16 76.66,32 76.66,30.63 | 81.38,37.95 81.38,38.86 78.64,41.6 78.18,41.6 IC12.1 | v72.85,19.2 73.3,19.2 75.74,21.64 76.96,21.64 IC7.1 | v8.53,24.84 11.58,21.79 16.92,21.79 HIGHHIGH.10 | v4.57,26.21 3.96,26.21 2.74,27.43 2.74,33.38 12.04,42.67 16.92,42.67 LOWLOW.10 17.07,42.67 v20.27,42.67 | 47.4,41.76 47.4,39.62 46.18,38.41 43.89,38.41 40.39,34.9 40.39,34.59 IC1.8 40.23,34.44 v40.23,29.26 | 47.4,41.76 47.55,41.91 49.68,41.91 49.99,41.6 49.99,35.66 | 49.99,35.66 49.99,35.2 49.38,34.59 IC1.1 | 49.07,34.44 49.23,34.44 IC1.1 | 49.07,34.44 48.01,34.44 IC1.2 | v31.39,42.67 31.39,43.28 v32.31,44.2 33.98,45.87 43.28,45.87 47.4,41.76 | 49.99,35.66 v50.14,35.66 | v48.77,19.96 48.62,20.12 47.85,20.12 IC3.8 | 38.41,26.36 37.95,26.36 37.64,26.06 | 38.41,26.36 38.56,26.36 38.86,26.06 38.86,20.27 IC3.1 | 37.64,26.06 37.64,18.9 40.84,15.7 40.84,12.8 41,12.65 43.13,12.65 43.28,12.8 43.28,15.7 43.13,15.85 | 43.13,15.85 40.23,18.75 40.23,20.12 IC3.2 | v33.68,19.2 33.68,20.73 29.72,24.69 29.72,26.06 30.33,26.67 37.03,26.67 37.64,26.06 | v45.41,18.44 44.65,18.44 43.74,17.53 43.74,16.46 43.13,15.85 | 38.41,26.36 v38.41,27.43 | v49.99,28.8 49.99,33.53 49.07,34.44 | 49.07,34.44 IC1.1 | IC27.29 112.62,25.6 112.62,24.84 IC27.28 112.62,24.69 v114.15,24.69 | v117.5,21.34 117.5,19.05 IC27.18 | v122.07,23.32 123.44,24.69 124.05,24.69 IC27.6
  Bottom 0.152: 122.38,29.41 127.56,29.41 132.44,24.54 IC18.7 132.59,24.38 132.59,23.93 134.26,22.25 145.39,22.25 v147.98,24.84 149.5,23.32 IC17.7 149.66,23.16 149.66,22.55 152.4,19.81 | 122.38,29.41 119.02,29.41 118.42,30.02 118.42,30.48 IC27.39 | 122.38,29.41 v122.38,29.26 | 152.4,19.81 158.19,19.81 v161.54,23.16 162.15,23.16 162.46,23.47 IC14.7 162.61,23.62 162.61,24.08 163.37,24.84 164.29,24.84 164.44,24.69 164.44,22.4 164.13,22.1 164.13,20.88 164.44,20.57 173.13,20.57 v174.35,21.79 175.41,22.86 175.41,23.32 IC15.7 | 152.4,19.81 152.4,11.89 146,5.49 135.79,5.49 134.57,6.71 133.5,6.71 SV5.1 | v85.95,37.95 81.38,37.95
IN  (via drill 0.35)
  Top 0.152: 138.84,30.48 138.07,29.72 135.94,29.72 135.18,30.48 135.18,30.94 IC9.12 | 138.84,30.48 138.84,30.94 IC9.9 138.84,30.48 | RN1.13 169.62,22.71 169.62,27.13 173.89,31.39 173.89,44.81 J4.1 | 155.91,29.72 155.91,29.26 IC19.9 155.91,29.72 | 155.91,29.72 158.5,32.31 v161.09,32.31 | 138.84,30.48 139.6,29.72 142.04,29.72 v144.93,32.61 | 155.91,29.72 v154.69,30.94
  Bottom 0.152: v161.09,32.31 173.58,44.81 173.89,44.81 J4.1 | v144.93,32.61 145.39,32.61 147.83,35.05 150.57,35.05 v154.69,30.94
IN2_CLEAR
  Bottom 0.152: IC17.2 155.91,23.32 155.91,23.62 159.41,27.13 169.77,27.13 177.85,35.2 177.85,44.5 J1.4
IN_CLEAR
  Top 0.152: RN1.9 164.44,22.71 164.44,27.74 165.05,28.35 165.05,34.44 165.35,34.75 165.35,40.54 161.39,44.5 161.39,44.81 J4.6
  Bottom 0.152: IC17.3 154.69,23.32 154.69,26.36 156.51,28.19 156.51,40.08 161.24,44.81 J4.6
IN_HIGH_HIGH  (via drill 0.35)
  Top 0.152: 167.79,21.49 167.03,22.25 167.03,22.55 RN1.11 | 167.79,21.49 169.93,21.49 170.08,21.64 170.08,23.62 170.38,23.93 172.67,23.93 | 172.67,23.93 172.97,23.93 174.5,22.4 179.83,22.4 180.59,23.16 180.59,23.62 IC13.5 | v163.37,17.98 138.99,17.98 133.2,23.77 133.2,32.16 134.26,33.22 138.38,33.22 140.06,31.55 140.06,31.09 IC9.8 | v164.74,17.98 167.79,21.03 167.79,21.49 | 172.67,23.93 174.96,26.21 174.96,46.02 174.35,46.63 165.81,46.63 164.13,44.96 163.83,44.96 J4.5
  Bottom 0.152: v164.74,17.98 v163.37,17.98
IN_HIGH_LOW  (via drill 0.35)
  Top 0.152: IC9.6 138.99,24.99 138.99,25.45 141.12,27.58 151.03,27.58 151.94,28.5 151.94,29.11 IC19.12 152.09,29.26 v152.09,34.9 | v158.5,40.84 158.5,40.23 156.06,37.8 v154.99,37.8
  Bottom 0.152: v158.5,40.84 166.57,40.84 168.86,43.13 168.86,44.81 J4.3 | v152.09,34.9 v154.99,37.8
IN_LOW_HIGH
  Top 0.152: J4.4 166.27,44.81 166.27,28.8 165.51,28.04 165.51,27.43 165.66,27.28 165.66,22.71 RN1.10 165.66,22.55 165.66,21.18 165.05,20.57 154.53,20.57 | 154.53,20.57 154.53,20.73 153.62,21.64 153.01,21.64 152.71,21.95 152.71,25.6 153.31,26.21 153.31,29.11 IC19.11 | 154.53,20.57 154.53,20.12 154.23,19.81 139.6,19.81 135.18,24.23 135.18,24.84 IC9.3
IN_LOW_LOW  (via drill 0.35)
  Top 0.152: RN1.12 168.25,22.71 168.25,24.69 168.86,25.3 168.86,42.37 171.3,44.81 J4.2 | IC19.8 157.28,29.26 v159.72,31.7 162.76,28.65 163.53,28.65 163.83,28.96 163.83,30.94 157.89,36.88 154.99,36.88 153.01,38.86 v152.09,38.86 | v135.48,32.61 136.25,31.85 136.25,31.09 IC9.11
  Bottom 0.152: v159.72,31.7 159.72,33.07 171.45,44.81 J4.2 | v135.48,32.61 141.73,38.86 v152.09,38.86
MAIN_BUS0  (via drill 0.35)
  Top 0.152: v24.84,41.91 24.99,41.76 30.02,41.76 30.33,41.45 32.92,41.45 LOWHIGH.9 | v19.36,4.88 22.4,1.83 73.46,1.83 75.59,3.96 90.68,3.96 92.35,5.64 92.96,5.64 96.47,2.13 136.55,2.13 137.01,2.59 186.08,2.59 197.97,14.48 197.97,30.02 196.6,31.39 196.29,31.39 194.92,32.77 193.85,32.77 BACKBUS.1 | v17.37,5.79 17.37,6.86 13.56,10.67 13.56,22.4 16.61,25.45 16.61,26.06 14.94,27.74 7.77,27.74 6.25,29.26 5.94,29.26 4.72,30.48 4.72,31.85 3.81,32.77 FRONTBUS.1
  Bottom 0.152: FRONTBUS.1 3.81,32.92 12.19,41.3 16.92,41.3 LOWLOW.9 17.07,41.45 17.53,41.91 v24.84,41.91 | v19.36,4.88 18.44,5.79 v17.37,5.79
MAIN_BUS1  (via drill 0.35)
  Top 0.152: v28.65,42.37 28.96,42.06 34.14,42.06 34.29,41.91 34.29,41 33.53,40.23 33.07,40.23 LOWHIGH.8 | v151.64,40.23 v157.58,40.23
  Bottom 0.152: FRONTBUS.2 6.4,32.92 13.56,40.08 16.92,40.08 LOWLOW.8 17.07,40.23 17.53,40.23 18.59,41.3 25.15,41.3 25.91,42.06 28.35,42.06 v28.65,42.37 33.07,46.79 116.13,46.79 122.68,40.23 v151.64,40.23 | v157.58,40.23 166.42,40.23 169.93,43.74 169.93,45.57 171.15,46.79 183.03,46.79 184.1,45.72 184.1,43.74 185.01,42.82 185.17,42.82 195.07,32.92 196.14,32.92 BACKBUS.2
MAIN_BUS2  (via drill 0.35)
  Top 0.152: 34.59,39.93 33.68,39.01 33.07,39.01 LOWHIGH.7 | 34.59,39.93 34.59,42.82 34.14,43.28 25.3,43.28 24.08,42.06 21.03,42.06 19.05,40.08 v18.59,40.08 | v168.25,14.78 172.06,18.59 193.55,18.59 194.77,19.81 194.77,20.12 195.83,21.18 196.14,21.18 197.36,22.4 197.36,23.01 196.6,23.77 196.29,23.77 195.22,24.84 195.22,25.15 194.16,26.21 193.24,26.21 190.96,28.5 190.96,29.11 192.18,30.33 193.7,30.33 BACKBUS.3 | v153.01,14.78 139.9,14.78 128.93,25.76 v128.93,30.79 | v85.04,42.06 84.12,42.98 65.68,42.98 65.38,43.28 64.31,43.28 v64.01,42.98 | v55.78,42.37 55.78,39.62 54.1,37.95 36.58,37.95 34.59,39.93
  Bottom 0.152: FRONTBUS.3 3.81,30.48 4.72,31.39 6.25,31.39 13.72,38.86 16.92,38.86 LOWLOW.7 17.07,39.01 17.53,39.01 v18.59,40.08 | v153.01,14.78 v168.25,14.78 | v128.93,30.79 128.47,30.79 117.2,42.06 v85.04,42.06 | v64.01,42.98 56.39,42.98 v55.78,42.37
MAIN_BUS3  (via drill 0.35)
  Top 0.152: 25.45,33.53 25.15,33.22 21.03,33.22 20.73,33.53 15.24,33.53 14.02,32.31 14.02,31.85 12.34,30.18 6.55,30.18 6.4,30.33 FRONTBUS.4 | 25.45,33.53 29.26,37.34 29.26,37.95 28.19,39.01 28.19,40.08 28.5,40.39 29.11,40.39 29.41,40.08 29.41,39.47 31.24,37.64 32.92,37.64 LOWHIGH.6 | v191.57,28.8 193.55,28.8 195.07,30.33 196.14,30.33 BACKBUS.4 | v92.66,5.03 v95.56,2.13 | v75.44,7.16 73.46,5.18 v61.27,5.18 | v32.77,28.35 v32.77,25.76 | v28.5,30.63 25.6,33.53 25.45,33.53
  Bottom 0.152: LOWLOW.6 16.92,37.49 13.41,37.49 6.4,30.48 FRONTBUS.4 | v191.57,28.8 175.41,12.65 153.62,12.65 143.1,2.13 v95.56,2.13 | v92.66,5.03 91.44,5.03 89.61,6.86 83.52,6.86 83.21,7.16 v75.44,7.16 | v61.27,5.18 52.73,5.18 52.43,5.49 46.94,5.49 39.47,12.95 39.47,16.61 35.51,20.57 35.51,23.01 v32.77,25.76 | v32.77,28.35 30.79,28.35 v28.5,30.63
MAIN_BUS4  (via drill 0.35)
  Top 0.152: v28.65,34.44 30.48,36.27 32.92,36.27 LOWHIGH.5 | v23.01,30.33 19.51,30.33 v18.59,31.24 | v183.64,31.39 180.59,31.39 v176.17,35.81 | v169.47,34.29 v170.99,35.81 | v157.73,32.46 157.28,32.46 v154.69,35.05 | v150.72,37.64 150.72,38.1 150.11,38.71 150.11,42.82 149.81,43.13 122.38,43.13 118.87,46.63 14.17,46.63 v13.56,46.02 | v13.56,43.89 13.56,43.28 9.75,39.47 v9.75,31.85
  Bottom 0.152: 15.7,36.27 13.72,36.27 9.3,31.85 | 15.7,36.27 16.92,36.27 LOWLOW.5 | 9.3,31.85 7.62,30.18 7.62,27.74 6.71,26.82 4.72,26.82 3.81,27.74 FRONTBUS.5 | v28.65,34.44 25.91,34.44 23.01,31.55 v23.01,30.33 | v18.59,31.24 18.59,32.61 17.98,33.22 15.85,33.22 15.7,33.38 15.7,36.27 | v183.64,31.39 194.16,31.39 194.77,30.79 194.77,29.87 193.85,28.96 193.85,27.89 BACKBUS.5 | v170.99,35.81 v176.17,35.81 | v169.47,34.29 163.98,34.29 160.78,31.09 159.11,31.09 v157.73,32.46 | v154.69,35.05 154.69,36.58 155.6,37.49 155.6,38.1 155.3,38.41 153.01,38.41 152.25,37.64 v150.72,37.64 | v13.56,43.89 v13.56,46.02 | 9.3,31.85 v9.75,31.85
MAIN_BUS5  (via drill 0.35)
  Top 0.152: v31.39,35.66 31.85,35.2 32.92,35.2 LOWHIGH.4 33.07,35.05 50.29,35.05 50.9,34.44 51.05,34.44 v51.36,34.14 | v158.65,11.43 153.31,16.76 138.38,16.76 130.45,24.69 v130.45,28.8 | v66.29,40.69 v91.75,40.69
  Bottom 0.152: 18.29,35.97 17.53,35.2 17.07,35.2 LOWLOW.4 | 18.29,35.97 18.29,36.73 17.98,37.03 14.02,37.03 7.32,30.33 7.32,28.8 6.4,27.89 FRONTBUS.6 | v31.39,35.66 31.39,38.1 31.7,38.41 31.7,39.01 31.39,39.32 29.26,39.32 28.19,38.25 23.01,38.25 20.73,35.97 18.29,35.97 | v158.65,11.43 178.31,11.43 193.09,26.21 193.55,26.21 195.07,27.74 196.14,27.74 BACKBUS.6 | v130.45,28.8 130,28.8 118.11,40.69 v91.75,40.69 | v66.29,40.69 60.2,40.69 53.65,34.14 v51.36,34.14
MAIN_BUS6  (via drill 0.35)
  Top 0.152: v16,25.76 10.36,25.76 8.84,24.23 4.72,24.23 3.81,25.15 FRONTBUS.7 | v29.26,32 30.94,33.68 32.92,33.68 LOWHIGH.3 | v24.99,32.16 24.38,32.16 24.08,31.85 21.95,31.85 20.57,33.22 15.39,33.22 14.33,32.16 14.33,31.24 v14.17,31.09 | v182.57,21.79 183.03,21.79 186.38,25.15 193.7,25.15 BACKBUS.7 | v153.01,17.37 138.23,17.37 131.83,23.77 131.83,27.13 v131.98,27.28 | v115.98,46.02 113.84,46.02 113.54,46.33 14.78,46.33 v2.44,33.98
  Bottom 0.152: v16,25.76 17.83,27.58 | 17.83,27.58 19.2,28.96 19.2,31.55 18.9,31.85 18.9,32.77 17.98,33.68 17.07,33.68 LOWLOW.3 | v29.26,32 28.19,32 28.04,31.85 25.3,31.85 v24.99,32.16 | v14.17,31.09 17.68,27.58 17.83,27.58 | v182.57,21.79 181.66,21.79 181.2,22.25 181.2,24.54 179.83,25.91 179.07,25.91 178.31,25.15 178.31,24.99 178,24.69 176.33,24.69 176.17,24.54 176.17,22.25 171.3,17.37 v153.01,17.37 | v131.98,27.28 133.96,29.26 134.11,29.26 134.42,29.57 134.42,31.7 126.19,39.93 122.07,39.93 v115.98,46.02 | v2.44,33.98 2.44,26.52 3.66,25.3 FRONTBUS.7
MAIN_BUS7  (via drill 0.35)
  Top 0.152: v37.19,34.14 35.66,32.61 33.07,32.61 LOWHIGH.2 | v42.52,45.26 33.98,45.26 33.83,45.41 16.61,45.41 12.04,40.84 v12.04,33.68 | v157.28,11.43 140.97,11.43 127.1,25.3 v127.1,30.02 | v120.24,35.97 98.75,35.97 91.44,43.28 68.12,43.28 67.51,43.89 v64.92,43.89 | v54.86,43.89 52.58,43.89 51.97,43.28 46.94,43.28 v45.87,42.22
  Bottom 0.152: LOWLOW.2 16.92,32.61 15.85,32.61 13.72,34.75 13.11,34.75 v12.04,33.68 10.36,32 10.36,28.04 7.62,25.3 6.4,25.3 FRONTBUS.8 | v37.19,34.14 42.06,39.01 45.57,39.01 46.02,39.47 46.02,41.76 45.72,42.06 | v42.52,45.26 45.72,42.06 | v157.28,11.43 161.39,7.32 174.65,7.32 188.52,21.18 193.55,21.18 194.77,22.4 194.77,22.71 196.14,24.08 196.14,25.15 BACKBUS.8 | v127.1,30.02 121.16,35.97 v120.24,35.97 | v54.86,43.89 v64.92,43.89 | 45.72,42.06 v45.87,42.22
MAIN_BUS8  (via drill 0.35)
  Top 0.152: v9.91,20.57 6.71,23.77 4.72,23.77 3.81,22.86 FRONTBUS.9 | v20.42,22.4 20.73,22.71 23.93,22.71 26.06,20.57 32,20.57 HIGHLOW.9
  Bottom 0.152: v9.91,20.57 16.92,20.57 HIGHHIGH.9 17.07,20.57 18.59,20.57 v20.42,22.4 | BACKBUS.9 193.85,22.86 193.85,23.93 195.22,25.3 195.22,25.6 195.83,26.21 196.75,26.21 197.36,25.6 197.36,22.4 196.14,21.18 195.83,21.18 194.77,20.12 194.77,19.81 193.55,18.59 193.09,18.59 175.72,1.22 24.84,1.22 22.71,3.35 13.11,3.35 1.52,14.94 1.52,20.57 3.66,22.71 FRONTBUS.9
MAIN_BUS9  (via drill 0.35)
  Top 0.152: v20.42,19.96 20.57,19.81 23.01,19.81 23.62,19.2 32,19.2 HIGHLOW.8 | v164.59,12.04 173.74,21.18 193.55,21.18 195.07,22.71 196.14,22.71 BACKBUS.10 | v26.21,5.94 v29.11,3.05 | v11.89,7.77 11.89,8.08 4.72,15.24 4.72,15.54 3.66,16.61 3.35,16.61 2.74,17.22 v2.74,19.36
  Bottom 0.152: 6.4,22.71 9.91,19.2 16.92,19.2 HIGHHIGH.8 17.07,19.2 17.53,19.2 18.29,19.96 v20.42,19.96 | v164.59,12.04 153.92,12.04 143.41,1.52 30.63,1.52 v29.11,3.05 | v26.21,5.94 25.76,5.94 24.99,6.71 15.7,6.71 14.63,7.77 v11.89,7.77 | v2.74,19.36 2.74,20.57 3.66,21.49 5.18,21.49 6.4,22.71 | 6.4,22.71 FRONTBUS.10
MAIN_BUS10  (via drill 0.35)
  Top 0.152: v19.81,16 23.77,16 25.6,17.83 32,17.83 HIGHLOW.7 | v175.56,1.98 136.85,1.98 136.4,1.52 87.02,1.52 v86.11,2.44 | v84.28,2.44 76.35,2.44 75.13,1.22 21.03,1.22 15.54,6.71 15.54,6.86 7.32,15.09 7.32,15.54 6.25,16.61 5.94,16.61 4.72,17.83 4.72,19.2 3.81,20.12 FRONTBUS.11
  Bottom 0.152: FRONTBUS.11 3.81,20.12 4.72,19.2 6.1,19.2 7.32,17.98 16.92,17.98 HIGHHIGH.7 17.07,17.83 17.53,17.83 19.36,16 v19.81,16 | v175.56,1.98 193.7,20.12 BACKBUS.11 | v84.28,2.44 v86.11,2.44
MAIN_BUS11  (via drill 0.35)
  Top 0.152: FRONTBUS.12 6.4,20.12 v9.75,16.76 v11.73,14.78 | 41.76,16.61 32.16,16.61 HIGHLOW.6 | 41.76,16.61 42.52,15.85 42.52,15.24 41.6,14.33 38.41,14.33 v37.03,12.95 | v39.01,9.3 35.51,9.3 33.98,7.77 v27.43,7.77 | v146.15,8.08 147.52,6.71 189.74,6.71 197.66,14.63 197.66,17.68 196.29,19.05 196.29,20.12 BACKBUS.12 | v126.19,30.02 v126.19,28.04 | v121.77,34.44 96.16,34.44 90.83,39.78 67.67,39.78 v66.29,38.41 | v55.93,27.43 51.66,27.43 51.05,28.04 48.46,28.04 v48.01,27.58 | v42.06,18.29 42.06,16.92 41.76,16.61
  Bottom 0.152: v9.75,16.76 16.92,16.76 HIGHHIGH.6 | v37.03,12.95 37.03,12.04 39.01,10.06 v39.01,9.3 | v27.43,7.77 26.21,7.77 20.73,13.26 18.29,13.26 18.14,13.41 13.11,13.41 v11.73,14.78 | v126.19,28.04 v146.15,8.08 | v121.77,34.44 v126.19,30.02 | v66.29,38.41 66.29,37.64 65.23,36.58 65.23,33.83 58.83,27.43 v55.93,27.43 | v48.01,27.58 48.01,27.13 42.06,21.18 v42.06,18.29
MAIN_BUS12  (via drill 0.35)
  Top 0.152: 34.9,14.02 33.07,12.19 28.65,12.19 26.36,9.91 25.91,9.91 25.6,9.6 v23.47,9.6 | 34.9,14.02 35.05,14.17 35.05,15.09 34.75,15.39 32.16,15.39 HIGHLOW.5 | v178.16,1.98 176.48,1.98 175.72,1.22 86.41,1.22 84.58,3.05 76.05,3.05 v75.74,2.74 | v53.34,8.38 52.73,8.99 v49.68,8.99 | v48.77,14.63 42.37,14.63 41.76,14.02 39.01,14.02 37.34,12.34 36.58,12.34 34.9,14.02
  Bottom 0.152: 4.27,17.07 3.81,17.53 FRONTBUS.13 | 4.27,17.07 4.72,16.61 6.25,16.61 7.47,15.39 16.92,15.39 HIGHHIGH.5 | v23.47,9.6 12.65,9.6 12.04,8.99 8.38,8.99 2.74,14.63 2.74,15.54 4.27,17.07 | v178.16,1.98 193.7,17.53 BACKBUS.13 | v75.74,2.74 67.97,2.74 62.33,8.38 v53.34,8.38 | v49.68,8.99 47.7,10.97 47.7,12.19 48.77,13.26 v48.77,14.63
MAIN_BUS13  (via drill 0.35)
  Top 0.152: 30.33,14.17 29.87,14.17 29.57,14.48 v24.08,14.48 | 30.33,14.17 32,14.17 HIGHLOW.4 | v147.37,7.77 148.13,7.01 189.59,7.01 197.36,14.78 197.36,15.39 196.29,16.46 196.29,17.53 BACKBUS.14 | v127.25,14.48 122.38,14.48 122.07,14.78 118.87,14.78 117.5,13.41 v97.38,13.41 | v95.71,15.09 84.89,15.09 v84.58,15.39 | v82.75,13.56 82.3,13.56 81.99,13.87 77.72,13.87 75.44,16.15 71.02,16.15 65.99,11.12 50.9,11.12 49.53,12.5 40.84,12.5 39.17,10.82 v36.88,10.82 | 30.33,14.17 v30.33,13.72
  Bottom 0.152: 18.29,14.94 17.53,14.17 17.07,14.17 HIGHHIGH.4 | 18.29,14.94 18.29,15.85 18.14,16 7.92,16 6.4,17.53 FRONTBUS.14 | v24.08,14.48 18.75,14.48 18.29,14.94 | v147.37,7.77 146.76,7.77 144.78,5.79 138.07,5.79 137.01,6.86 137.01,7.16 135.94,8.23 133.04,8.23 127.25,14.02 v127.25,14.48 | v95.71,15.09 v97.38,13.41 | v82.75,13.56 v84.58,15.39 | v36.88,10.82 34.29,10.82 31.39,13.72 v30.33,13.72
MAIN_BUS14  (via drill 0.35)
  Top 0.152: HIGHLOW.3 32,12.8 28.8,12.8 26.98,10.97 v20.12,10.97 18.75,12.34 14.63,12.34 14.17,11.89 14.17,10.97 18.75,6.4 18.75,4.57 21.79,1.52 73.61,1.52 75.44,3.35 v85.19,3.35 | v136.4,3.35 142.04,8.99 147.52,8.99 148.13,8.38 175.26,8.38 181.97,15.09 193.7,15.09 BACKBUS.15
  Bottom 0.152: 18.14,10.97 18.29,11.12 18.29,12.04 17.53,12.8 17.07,12.8 HIGHHIGH.3 | 18.14,10.97 15.54,10.97 14.48,9.91 12.5,9.91 11.89,9.3 9.6,9.3 3.81,15.09 FRONTBUS.15 | 18.14,10.97 v20.12,10.97 | v85.19,3.35 v136.4,3.35
MAIN_BUS15  (via drill 0.35)
  Top 0.152: v15.09,11.43 16.92,9.6 19.66,9.6 20.57,8.69 25.6,8.69 26.21,9.3 32.77,9.3 33.38,9.91 33.38,10.67 32.61,11.43 32.16,11.43 HIGHLOW.2 | v96.77,2.74 136.7,2.74 142.65,8.69 147.37,8.69 148.74,7.32 187.3,7.32 195.07,15.09 196.14,15.09 BACKBUS.16 | v13.41,7.16 6.4,14.17 6.4,15.09 FRONTBUS.16
  Bottom 0.152: 15.09,11.58 9.91,11.58 6.4,15.09 FRONTBUS.16 | 15.09,11.58 16.92,11.58 HIGHHIGH.2 | 15.09,11.58 v15.09,11.43 | v96.77,2.74 96.32,2.74 96.01,3.05 87.63,3.05 86.41,1.83 47.85,1.83 45.41,4.27 43.28,4.27 42.67,3.66 16.92,3.66 v13.41,7.16
N$1
  Bottom 0.152: IC17.4 153.31,23.32 153.31,23.62 151.18,25.76 141.43,25.76 140.21,24.54 IC18.1
N$2
  Bottom 0.152: IC18.3 137.62,24.54 137.62,25.45 138.53,26.36 149.5,26.36 151.94,28.8 151.94,29.26 IC17.10
N$3  (via drill 0.35)
  Top 0.152: v163.07,27.74 155.6,27.74 154.69,28.65 154.69,29.11 IC19.10 | v166.12,27.74 166.12,26.82 v167.79,25.15
  Bottom 0.152: v166.12,27.74 v163.07,27.74 | v167.79,25.15 168.86,24.08 168.86,23.62 IC14.2
N$4  (via drill 0.35)
  Top 0.152: v153.92,20.42 141.58,20.42 138.23,23.77 138.23,25.91 140.21,27.89 149.96,27.89 150.72,28.65 150.72,29.11 IC19.13
  Bottom 0.152: v153.92,20.42 157.73,20.42 163.07,25.76 168.4,25.76 170.08,24.08 170.08,23.62 IC14.1
N$5
  Bottom 0.152: IC17.1 157.28,23.32 158.5,23.32 161.54,26.36 181.51,26.36 183.03,24.84 183.03,23.47 IC15.1
N$6  (via drill 0.35)
  Top 0.152: v138.23,29.11 135.18,29.11 133.81,30.48 133.81,30.94 IC9.13
  Bottom 0.152: v138.23,29.11 138.23,30.02 138.84,30.63 IC18.13
N$7  (via drill 0.35)
  Top 0.152: v149.66,21.34 149.66,23.01 IC19.1 | v151.79,19.2 164.13,19.2 166.27,21.34 v166.27,25.15
  Bottom 0.152: v151.79,19.2 v149.66,21.34 | v166.27,25.15 165.2,24.08 165.2,23.62 IC14.5
N$8  (via drill 0.35)
  Top 0.152: v164.74,21.18 154.69,21.18 153.47,22.4 153.47,23.01 IC19.4
  Bottom 0.152: v164.74,21.18 164.74,21.49 166.27,23.01 166.27,23.47 IC14.4
N$9  (via drill 0.35)
  Top 0.152: v136.4,32.61 137.47,31.55 137.47,31.09 IC9.10
  Bottom 0.152: v136.4,32.61 136.4,30.79 IC18.11
N$10  (via drill 0.35)
  Top 0.152: v149.5,24.84 150.11,24.23 150.11,21.95 150.42,21.64 151.18,21.64 151.49,21.95 151.49,25.3 v152.71,26.52
  Bottom 0.152: v149.5,24.84 148.9,25.45 147.68,25.45 145.39,23.16 139.75,23.16 138.99,23.93 138.99,24.38 IC18.2 | v152.71,26.52 152.71,26.98 154.53,28.8 154.53,29.26 IC17.12
N$11
  Bottom 0.152: IC17.11 153.31,29.41 153.31,31.24 149.81,34.75 147.98,34.75 145.24,32 142.34,32 140.51,33.83 139.9,33.83 137.62,31.55 137.62,30.79 IC18.12
N$12  (via drill 0.35)
  Top 0.152: v177.7,25.3 178,24.99 178,23.77 IC13.3
  Bottom 0.152: v177.7,25.3 176.94,26.06 161.7,26.06 157.43,21.79 154.23,21.79 153.92,22.1 153.92,24.38 152.71,25.6 151.79,25.6 151.33,26.06 138.68,26.06 138.23,25.6 138.23,23.32 138.07,23.16 137.16,23.16 136.4,23.93 136.4,24.38 IC18.4
N$13  (via drill 0.35)
  Top 0.152: v176.78,25.3 176.78,23.77 IC13.2 | v171.75,23.01 171.75,21.95 v168.4,18.59 | v153.01,18.59 139.9,18.59 v135.64,22.86
  Bottom 0.152: v176.78,25.3 175.56,25.3 175.11,25.76 174.5,25.76 v171.75,23.01 | v153.01,18.59 v168.4,18.59 | v135.64,22.86 135.64,26.06 135.79,26.21 135.79,29.41 135.18,30.02 135.18,30.63 IC18.10
N$14  (via drill 0.35)
  Top 0.152: v135.18,26.52 136.25,25.45 136.25,24.99 IC9.4
  Bottom 0.152: v135.18,26.52 135.18,24.54 IC18.5
N$15  (via drill 0.35)
  Top 0.152: v132.59,28.96 132.59,24.99 IC9.1
  Bottom 0.152: v132.59,28.96 133.66,30.02 133.66,30.63 IC18.9
N$16  (via drill 0.35)
  Top 0.152: v174.8,25.15 175.72,25.15 176.48,25.91 180.14,25.91 181.81,24.23 181.81,23.77 IC13.6
  Bottom 0.152: v174.8,25.15 171.91,22.25 168.4,22.25 167.64,23.01 167.64,23.47 IC14.3
N$17  (via drill 0.35)
  Top 0.152: v179.38,25.3 179.38,23.77 IC13.4
  Bottom 0.152: v179.38,25.3 179.38,24.99 180.59,23.77 180.59,23.47 IC15.3
N$18
  Bottom 0.152: IC27.1 124.05,28.8 123.6,28.8 121.16,26.36 121.16,22.1 126.19,17.07 126.19,12.95 131.37,7.77 134.87,7.77 135.79,6.86 SV5.3
N$19
  Bottom 0.152: IC27.3 124.21,27.13 124.82,27.13 135.79,16.15 135.79,9.45 SV5.4
N$20  (via drill 0.35)
  Top 0.152: v137.62,11.73 v136.4,12.95
  Bottom 0.152: v136.4,12.95 136.4,16.46 124.97,27.89 124.21,27.89 IC27.2 | v137.62,11.73 137.62,10.21 138.38,9.45 SV5.6
N$21
  Bottom 0.152: IC27.4 124.21,26.36 124.82,26.36 133.35,17.83 133.35,9.45 SV5.2
N$24
  Bottom 0.152: RN2.1 105.61,20.88 105.61,17.83 106.07,17.37 106.07,16.15 105.61,15.7 94.64,15.7 94.18,16.15 94.18,19.36 94.79,19.96 94.79,31.85 94.94,32 U$1.PIN13
N$25
  Bottom 0.152: RN2.2 104.24,21.03 104.24,24.84 104.85,25.45 104.85,31.7 105.16,32 U$1.PIN9
N$26
  Bottom 0.152: RN2.3 102.87,20.88 102.87,19.66 100.13,16.92 U$1.PIN4
N$27
  Bottom 0.152: RN2.4 101.65,21.03 101.65,21.49 100.89,22.25 96.16,22.25 96.01,22.1 96.01,17.83 95.1,16.92 U$1.PIN2
N$28  (via drill 0.35)
  Top 0.152: v100.43,19.36 94.94,19.36 92.51,16.92 U$1.PIN1
  Bottom 0.152: v100.43,19.36 100.43,20.88 RN2.5
N$29
  Bottom 0.152: RN2.6 99.21,20.88 99.21,19.66 100.13,18.75 101.19,18.75 102.26,19.81 102.26,25.91 101.04,27.13 101.04,29.26 98.3,32 97.69,32 U$1.PIN12
N$30
  Bottom 0.152: RN2.7 97.99,20.88 97.99,17.83 99.21,16.61 99.21,16.15 99.36,16 101.8,16 102.56,16.76 U$1.PIN5
N$31
  Bottom 0.152: RN2.8 96.62,20.88 96.62,17.83 97.54,16.92 U$1.PIN3
OUT  (via drill 0.35)
  Top 0.152: IC19.3 151.94,23.01 v151.94,21.34 151.33,20.73 149.35,20.73 148.9,21.18 148.9,25.15 149.2,25.45 v149.2,26.98 | v166.88,42.06 166.88,30.02 RN1.4 | v153.92,42.22 156.67,44.96 J3.1